# EAGLE design Ponte H - 2  (EAGLE 5.07)
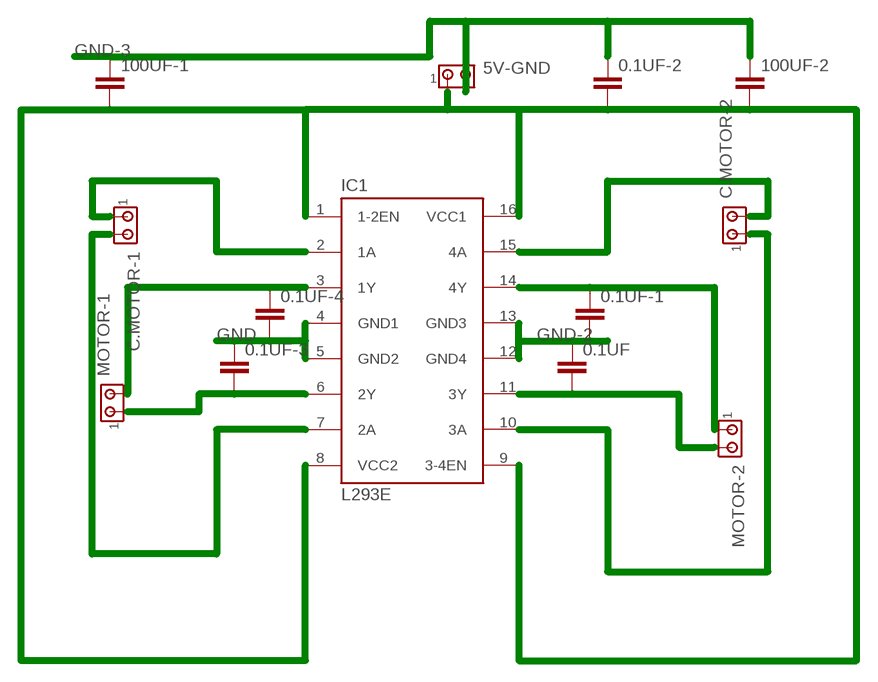
[diagram p0: schematic, sheet 1]

## Parts
0.1UF  C2.5/4  [C2.5-4]
0.1UF-1  C2.5/4  [C2.5-4]
0.1UF-2  C2.5/4  [C2.5-4]
0.1UF-3  C2.5/4  [C2.5-4]
0.1UF-4  C2.5/4  [C2.5-4]
5V-GND  MTA02-100  [10X02MTA]
100UF-1  C2.5/5  [C2.5-5]
100UF-2  C2.5/5  [C2.5-5]
C.MOTOR-1  MTA02-100  [10X02MTA]
C.MOTOR-2  MTA02-100  [10X02MTA]
IC1  L293E  [DIL16]
MOTOR-1  MTA02-100  [10X02MTA]
MOTOR-2  MTA02-100  [10X02MTA]

## Nets
GND: 0.1UF-3.1 0.1UF-4.2 IC1.4(GND1) IC1.5(GND2)
GND-2: 0.1UF-1.2 0.1UF.1 IC1.12(GND4) IC1.13(GND3)
GND-3: 0.1UF-2.1 5V-GND.2 100UF-1.1 100UF-2.1
N$3: C.MOTOR-2.2 IC1.15(4A)
N$4: C.MOTOR-2.1 IC1.10(3A)
N$5: 0.1UF-1.1 IC1.14(4Y) MOTOR-2.1
N$6: 0.1UF.2 IC1.11(3Y) MOTOR-2.2
N$7: 0.1UF-2.2 5V-GND.1 100UF-1.2 100UF-2.2 IC1.1(1-2EN) IC1.8(VCC2) IC1.9(3-4EN) IC1.16(VCC1)
N$8: C.MOTOR-1.1 IC1.2(1A)
N$9: C.MOTOR-1.2 IC1.7(2A)
N$10: 0.1UF-3.2 IC1.6(2Y) MOTOR-1.1
N$11: 0.1UF-4.1 IC1.3(1Y) MOTOR-1.2

## Library data of the parts
0.1UF 0.1UF-1-0.1UF-4 100UF-1 100UF-2 = capacitor-wima:C: CAPACITOR naming: grid - package width
5V-GND C.MOTOR-1 C.MOTOR-2 MOTOR-1 MOTOR-2 = con-amp:MTA02-100: AMP connector
IC1 = texas:L293E: TI DEVICE

## Board
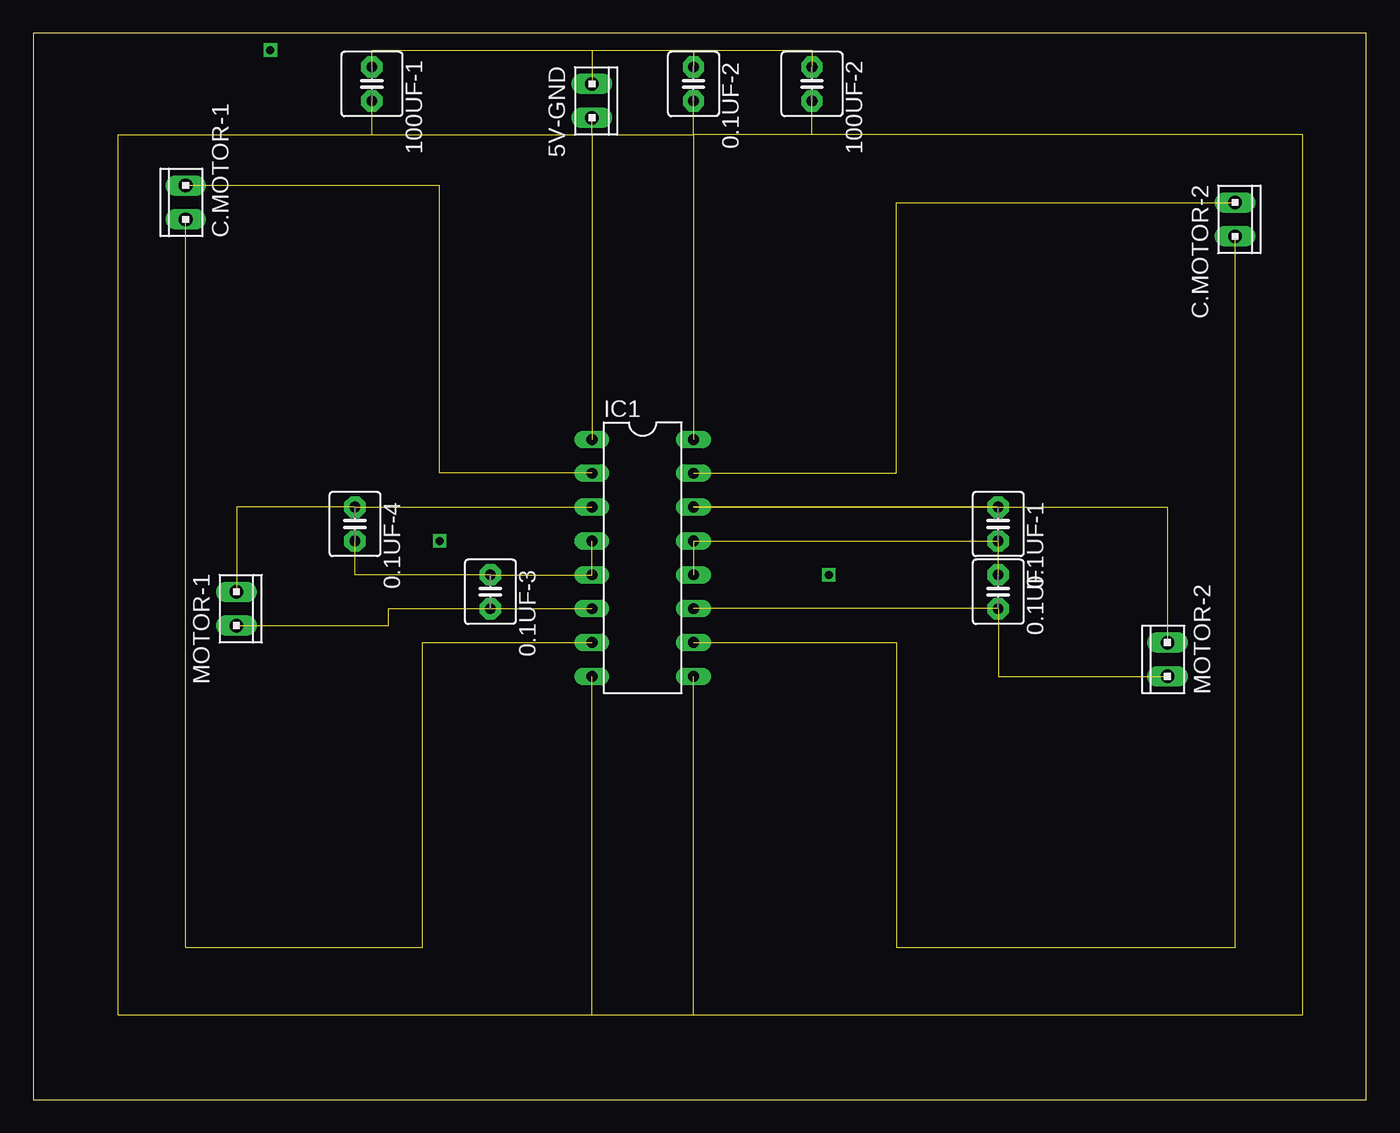
[diagram p1: board, top side]
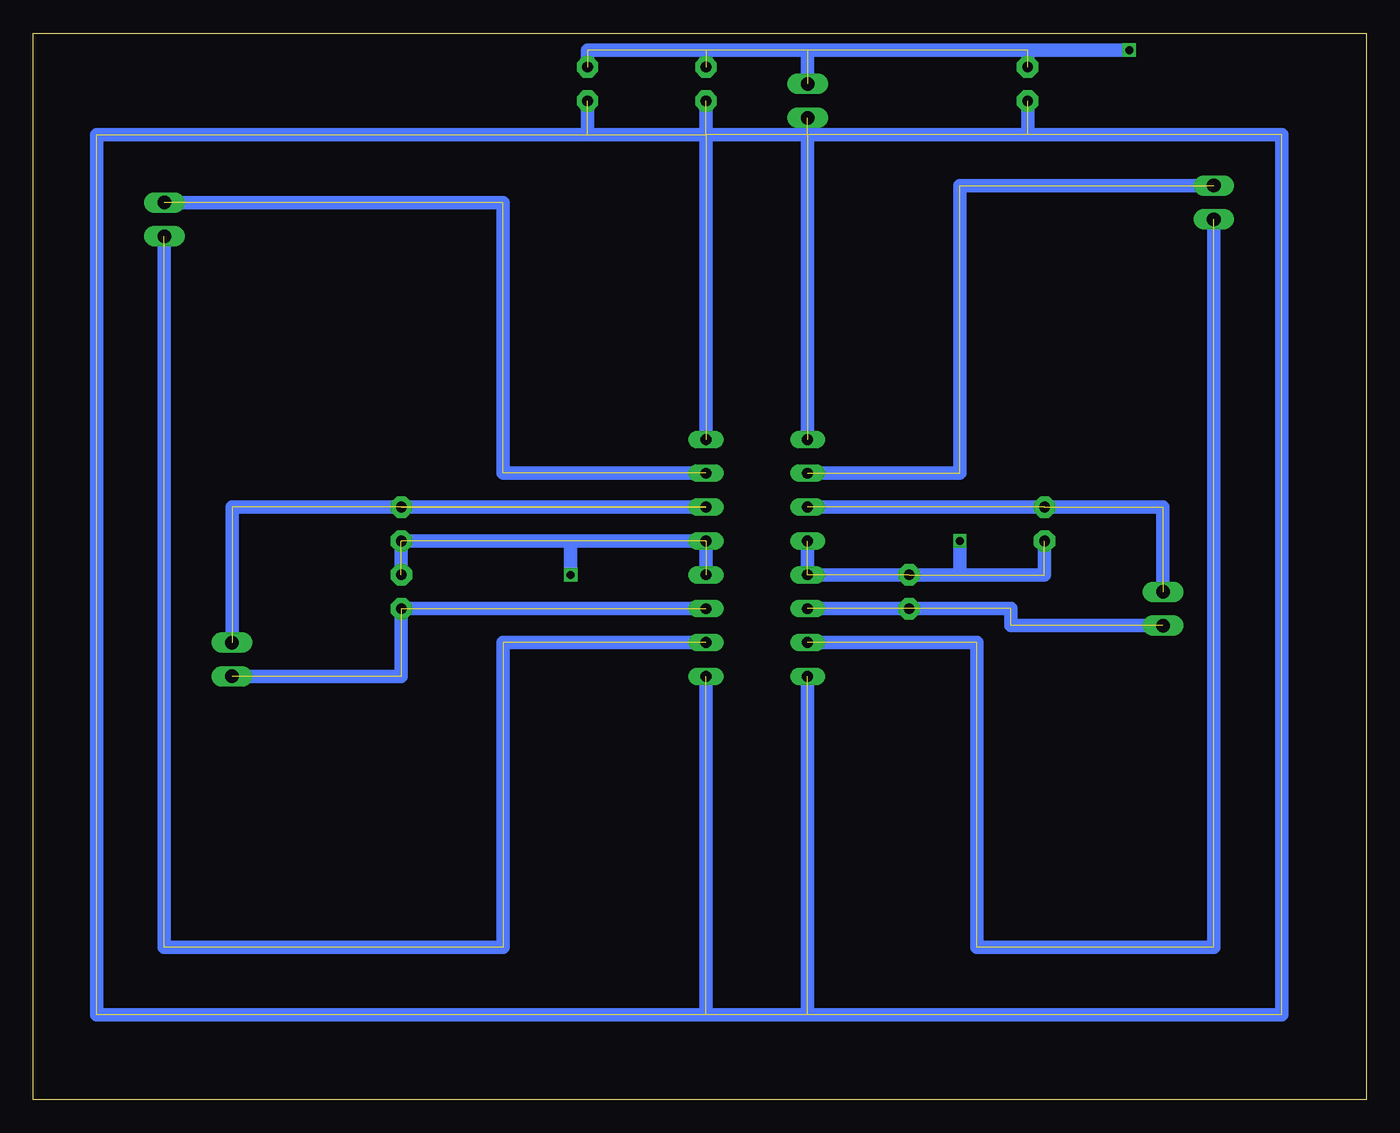
[diagram p2: board, bottom side, seen from below]

Size 100 x 80 mm. Coordinates in mm from the lower left corner, seen from the top.
Outline: 0,0 100,0 100,80 0,80 0,0
Copper layers (1*16): Top 0.035mm / dielectric 1.5mm / Bottom 0.035mm
Design rules "default": minimum track width 10mil, minimum drill 24mil, track to track 8mil, track to pad 8mil, pad to pad 8mil, via to via 8mil, smd to smd 8mil, copper to edge 40mil, drill to drill 8mil, minimum pad ring 10mil, minimum via ring 8mil, stop-mask expansion 4mil, vias tented up to drill 0mil, thermal gap 10mil

### Footprints (pad centres in the part's own frame; a part is rotated, then mirrored left to right if it is on the bottom)
C2.5-4 = drill 0.813 pad 1.6 octagon: 1 -1.27,0; 2 1.27,0
10X02MTA = drill 1.016 long: 1 1.27,0; 2 -1.27,0
C2.5-5 = drill 0.813 pad 1.6 octagon: 1 -1.27,0; 2 1.27,0
DIL16 = drill 0.813 long: 1 -8.89,-3.81; 2 -6.35,-3.81; 3 -3.81,-3.81; 4 -1.27,-3.81; 5 1.27,-3.81; 6 3.81,-3.81; 7 6.35,-3.81; 8 8.89,-3.81; 9 8.89,3.81; 10 6.35,3.81; 11 3.81,3.81; 12 1.27,3.81; 13 -1.27,3.81; 14 -3.81,3.81; 15 -6.35,3.81; 16 -8.89,3.81

### Placement (x,y rotation side)
0.1UF  72.39,38.1 270 top
0.1UF-1  72.39,43.18 270 top
0.1UF-2  49.53,76.2 270 top
0.1UF-3  34.29,38.1 270 top
0.1UF-4  24.13,43.18 270 top
5V-GND  41.91,74.93 270 top
100UF-1  25.4,76.2 270 top
100UF-2  58.42,76.2 270 top
C.MOTOR-1  11.43,67.31 90 top
C.MOTOR-2  90.17,66.04 270 top
IC1  45.72,40.64 270 top
MOTOR-1  15.24,36.83 270 top
MOTOR-2  85.09,33.02 90 top

### Tracks (layer width: path | path; a pad name or v marks a point on that pad's centre or on a via)
GND  (via drill 0.6)  (4 unrouted)
  Bottom 1.016: 0.1UF-4.2 24.13,39.37 30.48,39.37 | 30.48,39.37 IC1.5 IC1.4 | 30.48,39.37 v30.48,41.91
GND-2  (via drill 0.6)  (4 unrouted)
  Bottom 1.016: 0.1UF.1 0.1UF-1.2 59.69,41.91 | 59.69,41.91 IC1.13 IC1.12 | 59.69,41.91 v59.69,39.37
GND-3  (via drill 0.6)  (7 unrouted)
  Bottom 1.016: 100UF-1.1 25.4,78.74 | 25.4,78.74 41.91,78.74 | 41.91,78.74 49.53,78.74 | 49.53,78.74 58.42,78.74 100UF-2.1 | 49.53,78.74 0.1UF-2.1 | 41.91,78.74 5V-GND.2 | 25.4,78.74 v17.78,78.74
N$3  (7 unrouted)
  Bottom 1.016: IC1.15 64.77,46.99 64.77,67.31 C.MOTOR-2.2
N$4  (4 unrouted)
  Bottom 1.016: IC1.10 64.77,34.29 64.77,11.43 90.17,11.43 C.MOTOR-2.1
N$5  (3 unrouted)
  Bottom 0.406: IC1.14 0.1UF-1.1 85.09,44.45
  Bottom 1.016: MOTOR-2.1 85.09,44.45 IC1.14
N$6  (3 unrouted)
  Bottom 1.016: IC1.11 0.1UF.2 72.39,31.75 MOTOR-2.2
N$7  (18 unrouted)
  Bottom 1.016: IC1.8 41.91,6.35 | 41.91,6.35 6.35,6.35 6.35,72.39 25.4,72.39 | 25.4,72.39 41.91,72.39 | 41.91,72.39 49.53,72.39 | 49.53,72.39 58.42,72.39 | 58.42,72.39 95.25,72.39 95.25,6.35 49.53,6.35 | 41.91,6.35 49.53,6.35 | 49.53,6.35 IC1.9 | 25.4,72.39 100UF-1.2 | 41.91,72.39 5V-GND.1 | 49.53,72.39 0.1UF-2.2 | 58.42,72.39 100UF-2.2 | 49.53,72.39 IC1.16 | IC1.1 41.91,72.39
N$8  (3 unrouted)
  Bottom 1.016: IC1.2 30.48,46.99 30.48,68.58 C.MOTOR-1.1
N$9  (4 unrouted)
  Bottom 1.016: IC1.7 29.21,34.29 29.21,11.43 11.43,11.43 C.MOTOR-1.2
N$10  (4 unrouted)
  Bottom 1.016: IC1.6 0.1UF-3.2 26.67,36.83 26.67,35.56 MOTOR-1.1
N$11  (3 unrouted)
  Bottom 1.016: IC1.3 0.1UF-4.1 15.24,44.45 MOTOR-1.2